# Altium schematic sheet BOC_LED_DIPSWITCH.SchDoc: Board-On-Chip LEDs and DIP Switch
size A; Organization: Altium Limited; Address1: L3, 12a Rodborough Rd; Address2: Frenchs Forest; Address3: NSW; Address4: Australia 2086; Revision: 1.06; SheetNumber: 7; SheetTotal: 16
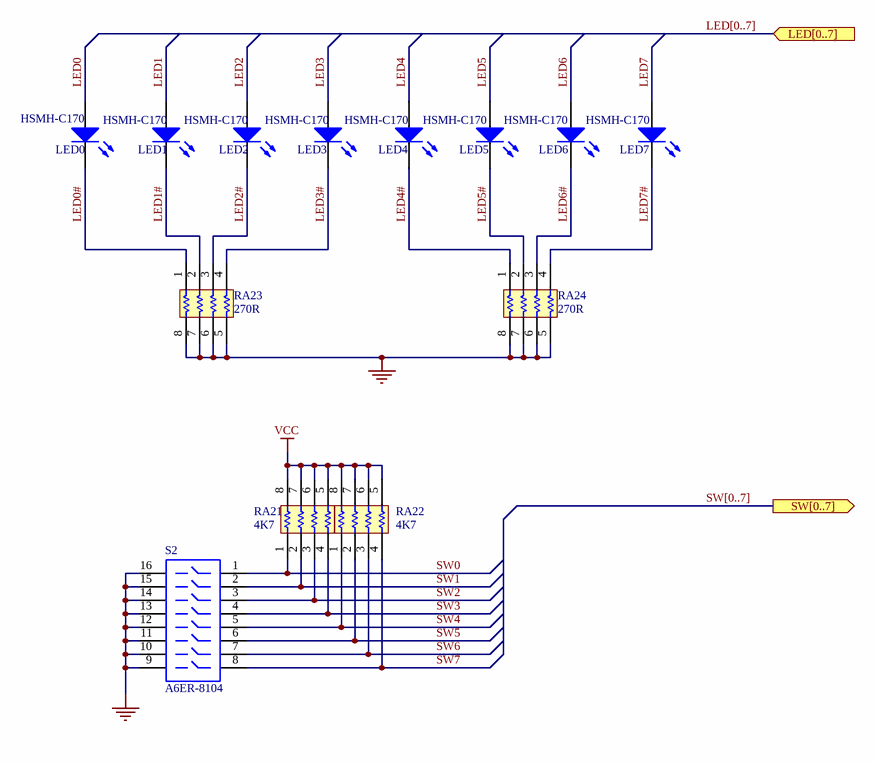
[diagram p0: BOC_LED_DIPSWITCH.SchDoc]

## Parts
LED0  HSMH-C170  [SMD _LED]
LED1  HSMH-C170  [SMD _LED]
LED2  HSMH-C170  [SMD _LED]
LED3  HSMH-C170  [SMD _LED]
LED4  HSMH-C170  [SMD _LED]
LED5  HSMH-C170  [SMD _LED]
LED6  HSMH-C170  [SMD _LED]
LED7  HSMH-C170  [SMD _LED]
RA21  4K7  [MNR34]
RA22  4K7  [MNR34]
RA23  270R  [MNR34]
RA24  270R  [MNR34]
S2  A6ER-8104  [DIP-16-KEY]

## Ports
LED[0..7] (in), SW[0..7] (out)

## Nets
GND: RA23.5 RA23.6 RA23.7 RA23.8 RA24.5 RA24.6 RA24.7 RA24.8 S2.9 S2.10 S2.11 S2.12 S2.13 S2.14 S2.15 S2.16
VCC: RA21.5 RA21.6 RA21.7 RA21.8 RA22.5 RA22.6 RA22.7 RA22.8
LED0: LED0.1(A)
LED0#: LED0.2(K) RA23.1
LED1: LED1.1(A)
LED1#: LED1.2(K) RA23.2
LED2: LED2.1(A)
LED2#: LED2.2(K) RA23.3
LED3: LED3.1(A)
LED3#: LED3.2(K) RA23.4
LED4: LED4.1(A)
LED4#: LED4.2(K) RA24.1
LED5: LED5.1(A)
LED5#: LED5.2(K) RA24.2
LED6: LED6.1(A)
LED6#: LED6.2(K) RA24.3
LED7: LED7.1(A)
LED7#: LED7.2(K) RA24.4
SW0: RA21.1 S2.1
SW1: RA21.2 S2.2
SW2: RA21.3 S2.3
SW3: RA21.4 S2.4
SW4: RA22.1 S2.5
SW5: RA22.2 S2.6
SW6: RA22.3 S2.7
SW7: RA22.4 S2.8

## Buses and harness runs
bus LED[0..7] = port LED[0..7]
bus SW[0..7] = port SW[0..7]

## Notes on the sheet
- Title
- Size:
- Date:
- A
- Number:
- Time:
- Revision:
- Sheet
- of
- File:

## Library data of the parts
LED0-LED7 = HSMX-C670: Typical RED GaAs SMD LED Agilent make; Manufacturer: Generic Components; Class I: Optoelectronic; Fitted: True; Published: 8-Jun-2000; Revision: July-2002: Re-released for DXP Platform.; Publisher: Altium Limited; Class II: LED
RA21-RA24 = MNR34: 3216x4 Resistor Array; Fitted: True
S2 = A6ER-8104: DIP Switch Side actuator long liver Piano Key; Manufacturer: Generic Components; Fitted: True; Published: 24-Mar-1999; Revision: July-2002: Re-released for DXP Platform.; Publisher: Altium Limited